# Altium schematic sheet POWER.SchDoc
size A4
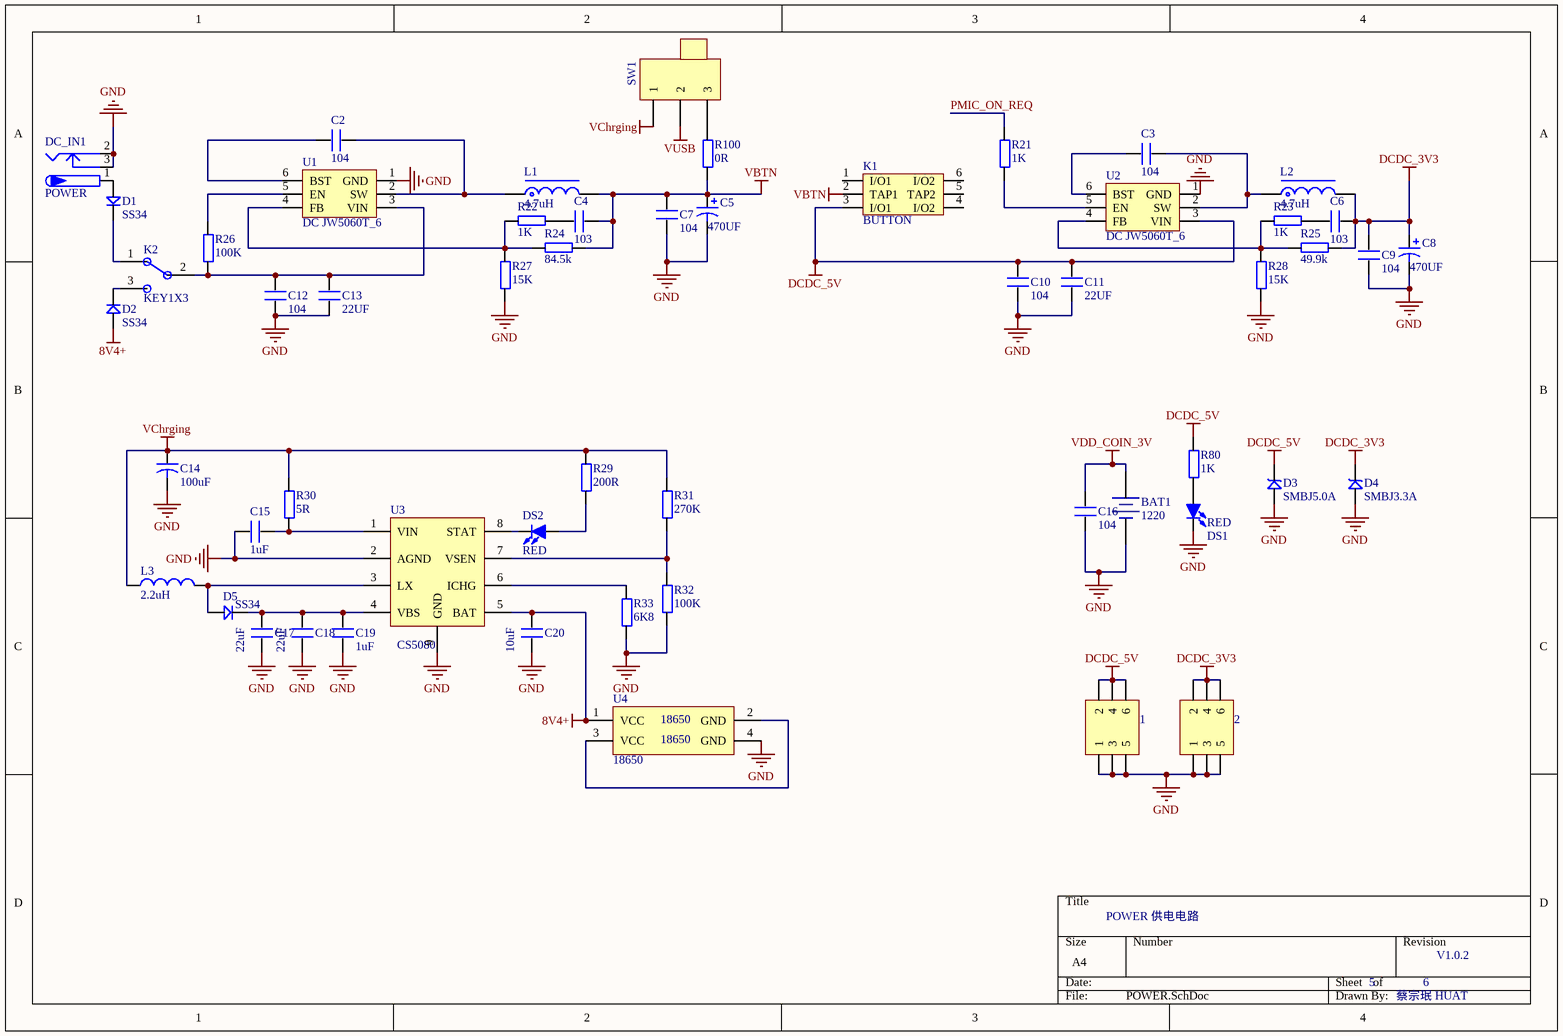
[diagram p0: POWER.SchDoc]

## Parts
1  RS232/RS485  [HDR-3X2]  (value not drawn)
2  RS232/RS485  [HDR-3X2]  (value not drawn)
BAT1  1220  [CR1220_B]
C2  104  [C_0603P]
C3  104  [C_0603P]
C4  103  [C_0603P]
C5  value 470UF  [CAP2.54M]  (hidden comment: Cap Pol1)
C6  103  [C_0603P]
C7  104  [C_0603P]
C8  value 470UF  [CAP2.54M]  (hidden comment: Cap Pol1)
C9  104  [C_0603P]
C10  104  [C_0603P]
C11  22UF  [C_0603P]
C12  104  [C_0603P]
C13  22UF  [C_0603P]
C14  value 100uF  [CAP2.54M]  (hidden comment: Cap2)
C15  1uF  [C_0603P]
C16  104  [C_0603P]
C17  22uF  [C_0603P]
C18  22uF  [C_0603P]
C19  1uF  [C_0603P]
C20  10uF  [C_0805]
D1  SS34  [DIODE 3*5.3]
D2  SS34  [DIODE 3*5.3]
D3  SMBJ5.0A  [SMBJ]
D4  SMBJ3.3A  [SMBJ]
D5  SS34  [DIODE 3*5.3]
DC_IN1  POWER  [DC10B]
DS1  RED  [LED 0805R]
DS2  RED  [LED 0805R]
K1  BUTTON  [BTN8.5*8.5]
K2  KEY1X3  [PKEY]
L1  4.7uH  [L-SMD-0420]
L2  4.7uH  [L-SMD-0420]
L3  2.2uH  [CD74 电感   7*7*4mm贴片]
R21  1K  [R_0603P]
R22  1K  [R_0603P]
R23  1K  [R_0603P]
R24  84.5k  [R_0603P]
R25  49.9k  [R_0603P]
R26  100K  [R_0603P]
R27  15K  [R_0603P]
R28  15K  [R_0603P]
R29  200R  [R_0603P]
R30  5R  [R_0805]
R31  270K  [R_0603P]
R32  100K  [R_0603P]
R33  6K8  [R_0603P]
R80  1K  [R_0603P]
R100  0R  [R_0805]
SW1  switch  [三脚拨动开关SS12D00G4]  (value not drawn)
U1  DC JW5060T_6  [SOT23-6N]
U2  DC JW5060T_6  [SOT23-6N]
U3  CS5080  [ESOP8   IP5306]
U4  18650  [18650 2节电池座 PCB插脚]

## Nets
8V4+: C20.2 D2.1 U3.5(BAT) U4.1(VCC)
DCDC_3V3: 2.2 2.4 2.6 C6.1 C8.1 C9.2 D4.2 L2.2 R25.1
DCDC_5V: 1.2 1.4 1.6 C10.2 C11.2 D3.2 K1.3(I/O1) R80.2 U2.3(VIN)
GND: 1.1 1.3 1.5 2.1 2.3 2.5 BAT1.2(DC-) C5.2 C7.1 C8.2 C9.1 C10.1 C11.1 C12.1 C13.1 C14.2 C15.1 C16.1 C17.1 C18.1 C19.1 C20.1 D3.1 D4.1 DC_IN1.2 DC_IN1.3 DS1.2(K) R27.1 R28.1 R32.1 R33.1 U1.1(GND) U2.1(GND) U3.2(AGND) U3.9(GND) U4.4(GND)
VBTN: C4.1 C5.1 C7.2 K1.2(TAP1) L1.2 R24.1 R100.1
VChrging: C14.1 L3.1 R29.2 R30.2 R31.2 SW1.1
VDD_COIN_3V: BAT1.1(DC+) C16.2
VUSB: SW1.2
PMIC_ON_REQ: R21.2
NetC2_1: C2.1 U1.6(BST)
NetC2_2: C2.2 L1.1 U1.2(SW)
NetC3_1: C3.1 U2.6(BST)
NetC3_2: C3.2 L2.1 U2.2(SW)
NetC4_2: C4.2 R22.1
NetC6_2: C6.2 R23.1
NetC12_2: C12.2 C13.2 K2.2 R26.1 U1.3(VIN)
NetC15_2: C15.2 R30.1 U3.1(VIN)
NetC17_2: C17.2 C18.2 C19.2 D5.2 U3.4(VBS)
NetD1_1: D1.1 DC_IN1.1
NetD1_2: D1.2 K2.1
NetD2_2: D2.2 K2.3
NetD5_1: D5.1 L3.2 U3.3(LX)
NetDS1_1: DS1.1(A) R80.1
NetDS2_1: DS2.1(A) R29.1
NetDS2_2: DS2.2(K) U3.8(STAT)
NetR21_1: R21.1 U2.5(EN)
NetR22_2: R22.2 R24.2 R27.2 U1.4(FB)
NetR23_2: R23.2 R25.2 R28.2 U2.4(FB)
NetR26_2: R26.2 U1.5(EN)
NetR31_1: R31.1 R32.2 U3.7(VSEN)
NetR33_2: R33.2 U3.6(ICHG)
NetR100_2: R100.2 SW1.3
NetU4_2: U4.2(GND) U4.3(VCC)

Not connected (* = marked no-connect by the designer): K1 1(I/O1) 4(I/O2) 5(TAP2) 6(I/O2)

## Notes on the sheet
- POWER 供电电路
- 5
- 6
- V1.0.2
- 蔡宗珉 HUAT

## Library data of the parts
1 2 = Header 3X2: 3*2P接插件; 版权归属: 源创客; BOM名称: 3*2P接插件; 学习资源: www.ooocke.com
BAT1 = CR-3V: 微型电池; 版权归属: 源创客; BOM名称: 微型电池; 学习资源: www.ooocke.com
C2-C4 C6 C7 C9-C13 C15-C20 = C
C5 C8 = Cap Pol1: Polarized Capacitor (Radial); Published: 8-Jun-2000; LatestRevisionDate: 17-Jul-2002; LatestRevisionNote: Re-released for DXP Platform.; PackageReference: RB7.6-15; Publisher: Altium Limited; PackageDescription: Polarized Capacitor (Radial); 2 Leads
C14 = Cap2: Capacitor; Published: 23-Sep-2002; PackageReference: CAPR5-4X5; Publisher: Altium Limited; PackageDescription: Capacitor; 2 Leads
D1 D2 D5 = D: 1N4148
D3 D4 = SMBJ: TVS
DC_IN1 = P-DC: 低压电源接口; BOM名称: DC电源接口; 版权归属: 源创客; 学习资源: www.ooocke.com
DS1 DS2 = LED-SMD: 贴片LED; 版权归属: 源创客; BOM名称: 贴片LED; 学习资源: www.ooocke.com
K2 = PKEY
L1 L2 = L-CDRH: 功率屏蔽电感; 版权归属: 源创客; BOM名称: 功率屏蔽电感; 学习资源: www.ooocke.com
L3 = Inductor: Code_IEC: 1005; Published: 8-Jun-2000; LatestRevisionDate: 17-Jul-2002; LatestRevisionNote: Re-released for DXP Platform.; PackageReference: 0402-A; Publisher: Altium Limited; Code_JEITA: 0402
R21-R33 R80 R100 = R
SW1 = 3脚拔动开关
U1 U2 = DC JW5060T_6: DC降压芯片
U3 = CS5080 5V输入8V4输出充电器IC: 5V输入8V4输出充电器IC
U4 = 18650 2节电池座 PCB插脚